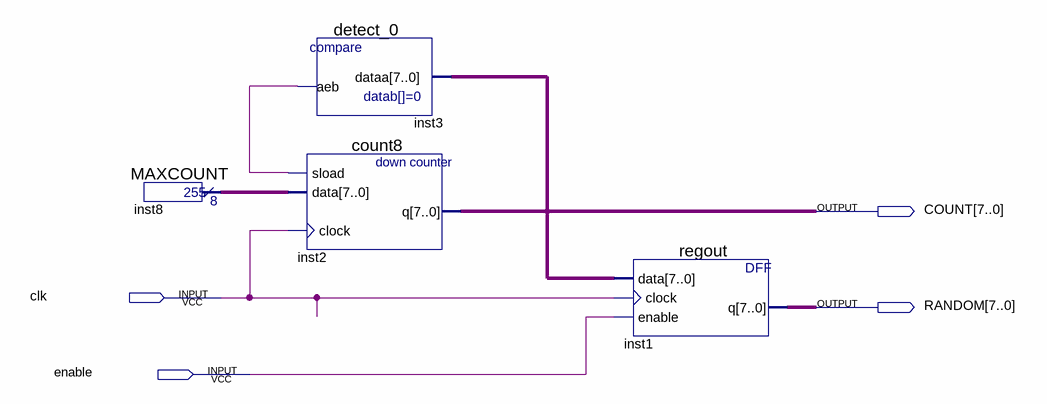
[diagram p0: schematic sheet]
// Quartus schematic Random.bdf as structural Verilog: 4 symbols, 4 pins
module Random (
  input  clk,
  input  enable,
  output [7:0] COUNT,
  output [7:0] RANDOM
);

  wire inst3_aeb;
  wire [7:0] inst8_result;

  MAXCOUNT inst8 (.result(inst8_result));
  detect_0 inst3 (.dataa(COUNT), .aeb(inst3_aeb));
  count8 inst2 (.sload(inst3_aeb), .data(inst8_result), .clock(clk), .q(COUNT));
  regout inst1 (.data(COUNT), .clock(clk), .enable(enable), .q(RANDOM));
endmodule
